# Altium schematic sheet Accelo_7seg.SchDoc: Emeleserzekelo
size A4; Author: Nyitrai Bence; Organization: BME-AUT; DocumentNumber: 1; Revision: A3; SheetNumber: 1; SheetTotal: 2
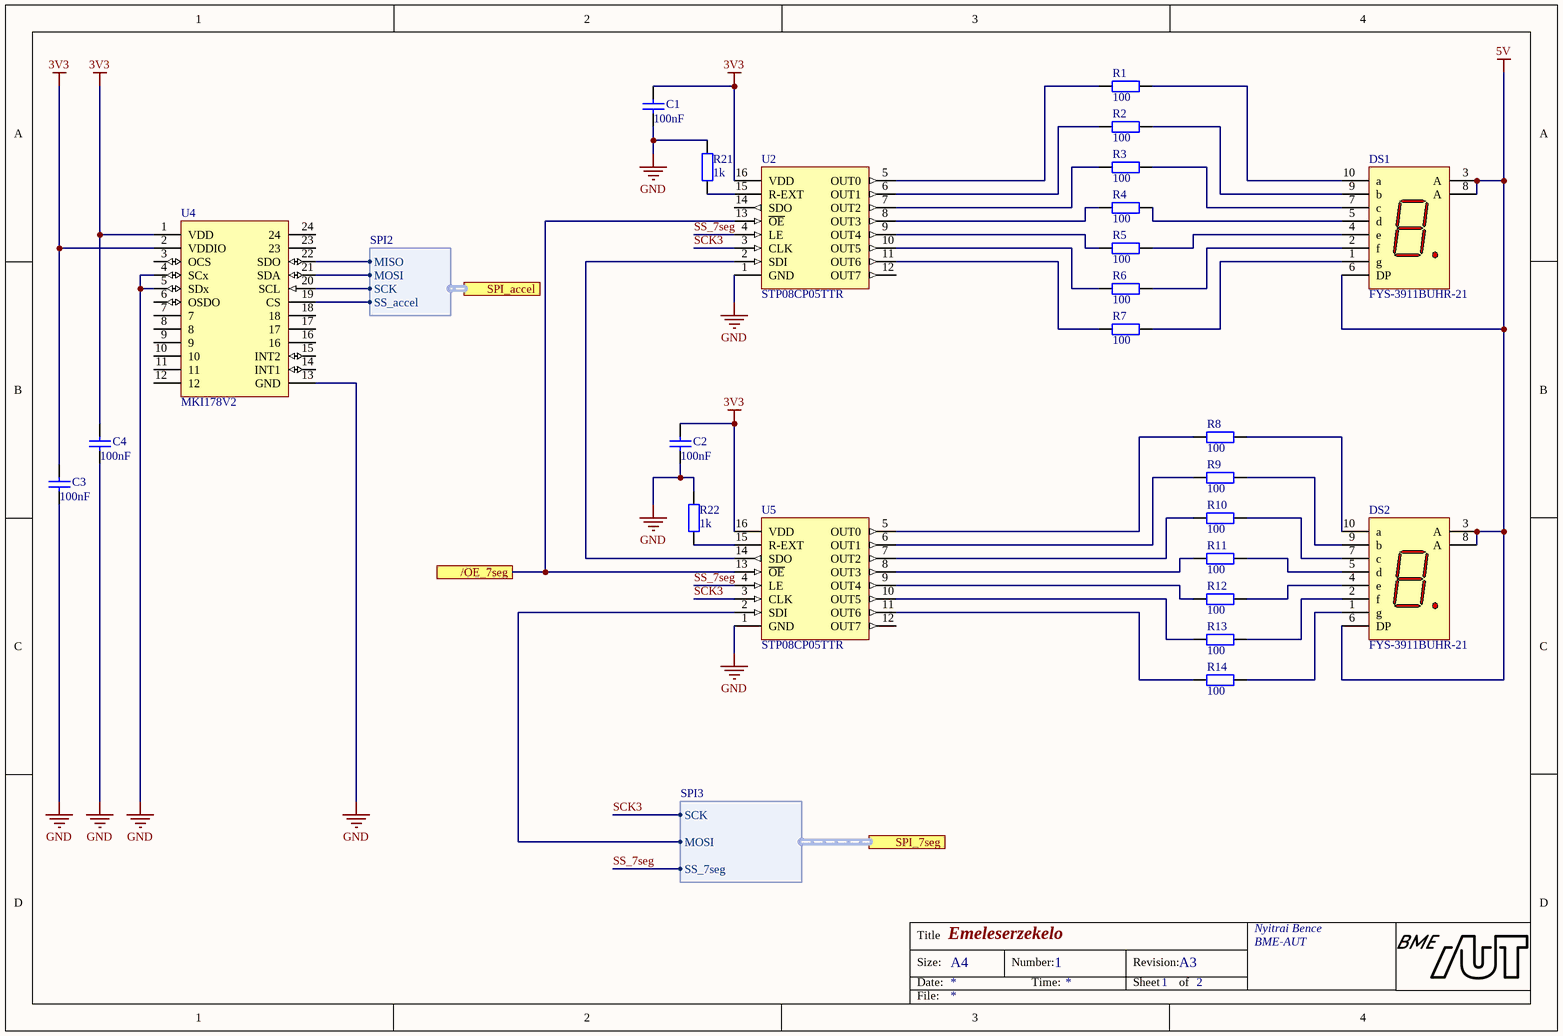
[diagram p0: Accelo_7seg.SchDoc]

## Parts
C1  100nF  [FP_0805_CAP_085]
C2  100nF  [FP_0805_CAP_085]
C3  100nF  [FP_0805_CAP_085]
C4  100nF  [FP_0805_CAP_085]
DS1  FYS-3911BUHR-21  [FP_7SEG]
DS2  FYS-3911BUHR-21  [FP_7SEG]
R1  100  [FP_0805_RES]
R2  100  [FP_0805_RES]
R3  100  [FP_0805_RES]
R4  100  [FP_0805_RES]
R5  100  [FP_0805_RES]
R6  100  [FP_0805_RES]
R7  100  [FP_0805_RES]
R8  100  [FP_0805_RES]
R9  100  [FP_0805_RES]
R10  100  [FP_0805_RES]
R11  100  [FP_0805_RES]
R12  100  [FP_0805_RES]
R13  100  [FP_0805_RES]
R14  100  [FP_0805_RES]
R21  1k  [FP_0805_RES]
R22  1k  [FP_0805_RES]
U2  STP08CP05TTR  [TSOP65P640X120-16M]
U4  MKI178V2  [FP_DIL24]
U5  STP08CP05TTR  [TSOP65P640X120-16M]

## Ports
/OE_7seg, SPI_7seg (harness SPI3), SPI_accel (harness SPI2)

## Harnesses
SPI2: MISO, SCK, MOSI, SS_accel
SPI3: MOSI, SCK, SS_7seg

## Nets
3V3: C1.2 C2.2 C3.2 C4.2 U2.16(VDD) U4.1(VDD) U4.2(VDDIO) U5.16(VDD)
5V: DS1.3(A) DS1.6(DP) DS1.8(A) DS2.3(A) DS2.6(DP) DS2.8(A)
GND: C1.1 C2.1 C3.1 C4.1 R21.1 R22.1 U2.1(GND) U4.4(SCx) U4.5(SDx) U4.13(GND) U5.1(GND)
/OE_7seg: U2.13(~{OE}) U5.13(~{OE}) ; port /OE_7seg
SCK3: U2.3(CLK) U5.3(CLK) ; port SPI_7seg.SCK
SS_7seg: U2.4(LE) U5.4(LE) ; port SPI_7seg.SS_7seg
NetDS1_1: DS1.1(g) R7.2
NetDS1_2: DS1.2(f) R6.2
NetDS1_4: DS1.4(e) R5.2
NetDS1_5: DS1.5(d) R4.2
NetDS1_7: DS1.7(c) R3.2
NetDS1_9: DS1.9(b) R2.2
NetDS1_10: DS1.10(a) R1.2
NetDS2_1: DS2.1(g) R14.2
NetDS2_2: DS2.2(f) R13.2
NetDS2_4: DS2.4(e) R12.2
NetDS2_5: DS2.5(d) R11.2
NetDS2_7: DS2.7(c) R10.2
NetDS2_9: DS2.9(b) R9.2
NetDS2_10: DS2.10(a) R8.2
NetR1_1: R1.1 U2.5(OUT0)
NetR2_1: R2.1 U2.6(OUT1)
NetR3_1: R3.1 U2.7(OUT2)
NetR4_1: R4.1 U2.8(OUT3)
NetR5_1: R5.1 U2.9(OUT4)
NetR6_1: R6.1 U2.10(OUT5)
NetR7_1: R7.1 U2.11(OUT6)
NetR8_1: R8.1 U5.5(OUT0)
NetR9_1: R9.1 U5.6(OUT1)
NetR10_1: R10.1 U5.7(OUT2)
NetR11_1: R11.1 U5.8(OUT3)
NetR12_1: R12.1 U5.9(OUT4)
NetR13_1: R13.1 U5.10(OUT5)
NetR14_1: R14.1 U5.11(OUT6)
NetR21_2: R21.2 U2.15(R-EXT)
NetR22_2: R22.2 U5.15(R-EXT)
NetU2_2: U2.2(SDI) U5.14(SDO)
NetU4_19: U4.19(CS) ; port SPI_accel.SS_accel
NetU4_20: U4.20(SCL) ; port SPI_accel.SCK
NetU4_21: U4.21(SDA) ; port SPI_accel.MOSI
NetU4_22: U4.22(SDO) ; port SPI_accel.MISO
NetU5_2: U5.2(SDI) ; port SPI_7seg.MOSI

Not connected (* = marked no-connect by the designer): U2 12(OUT7) 14(SDO); U4 3(OCS) 6(OSDO) 7 8 9 10 11 12 14(INT1) 15(INT2) 16 17 18 23 24; U5 12(OUT7)

## Notes on the sheet
- Title
- Size:
- Date:
- A4
- Number:
- Time:
- Revision:
- Sheet
- of
- File:

## Library data of the parts
C1-C4 = CAP: Capacitor; Name: 100nF 0805 10% 50V X7R 0805B104K500CT (WAL); Supplier: Lomex; Reference: 82-10-76; Value: 100nF
DS1 DS2 = 7SEG Red-CA: 7-Segment Display; ComponentLink1Description: Manufacturer Link; ComponentLink1URL: http://www.agilent.com/; Supplier: Lomex; Reference: 35-03-94; Name: FYS-3911BUHR-21
R1-R14 R21 R22 = RES: Resistor; Power: 125 mW; Name: 100R 0805 5% RC0805JR-10100RL 0.125W (YAG); Reference: [81-34-71; Supplier: Lomex
  R1-R14: Value: 100
  R21 R22: Value: 1k
U2 U5 = STP08CP05TTR: Low voltage, low current power 8-bit shift register; Supplier: ST tanszeki forras; Name: STP08CP05TTR
U4 = MKI160V1: LSM6DS3 inertial module adapter; Name: MKI178V2; Supplier: ST tanszeki forras